# EAGLE design imu_board_v1 (EAGLE 6.5.0)
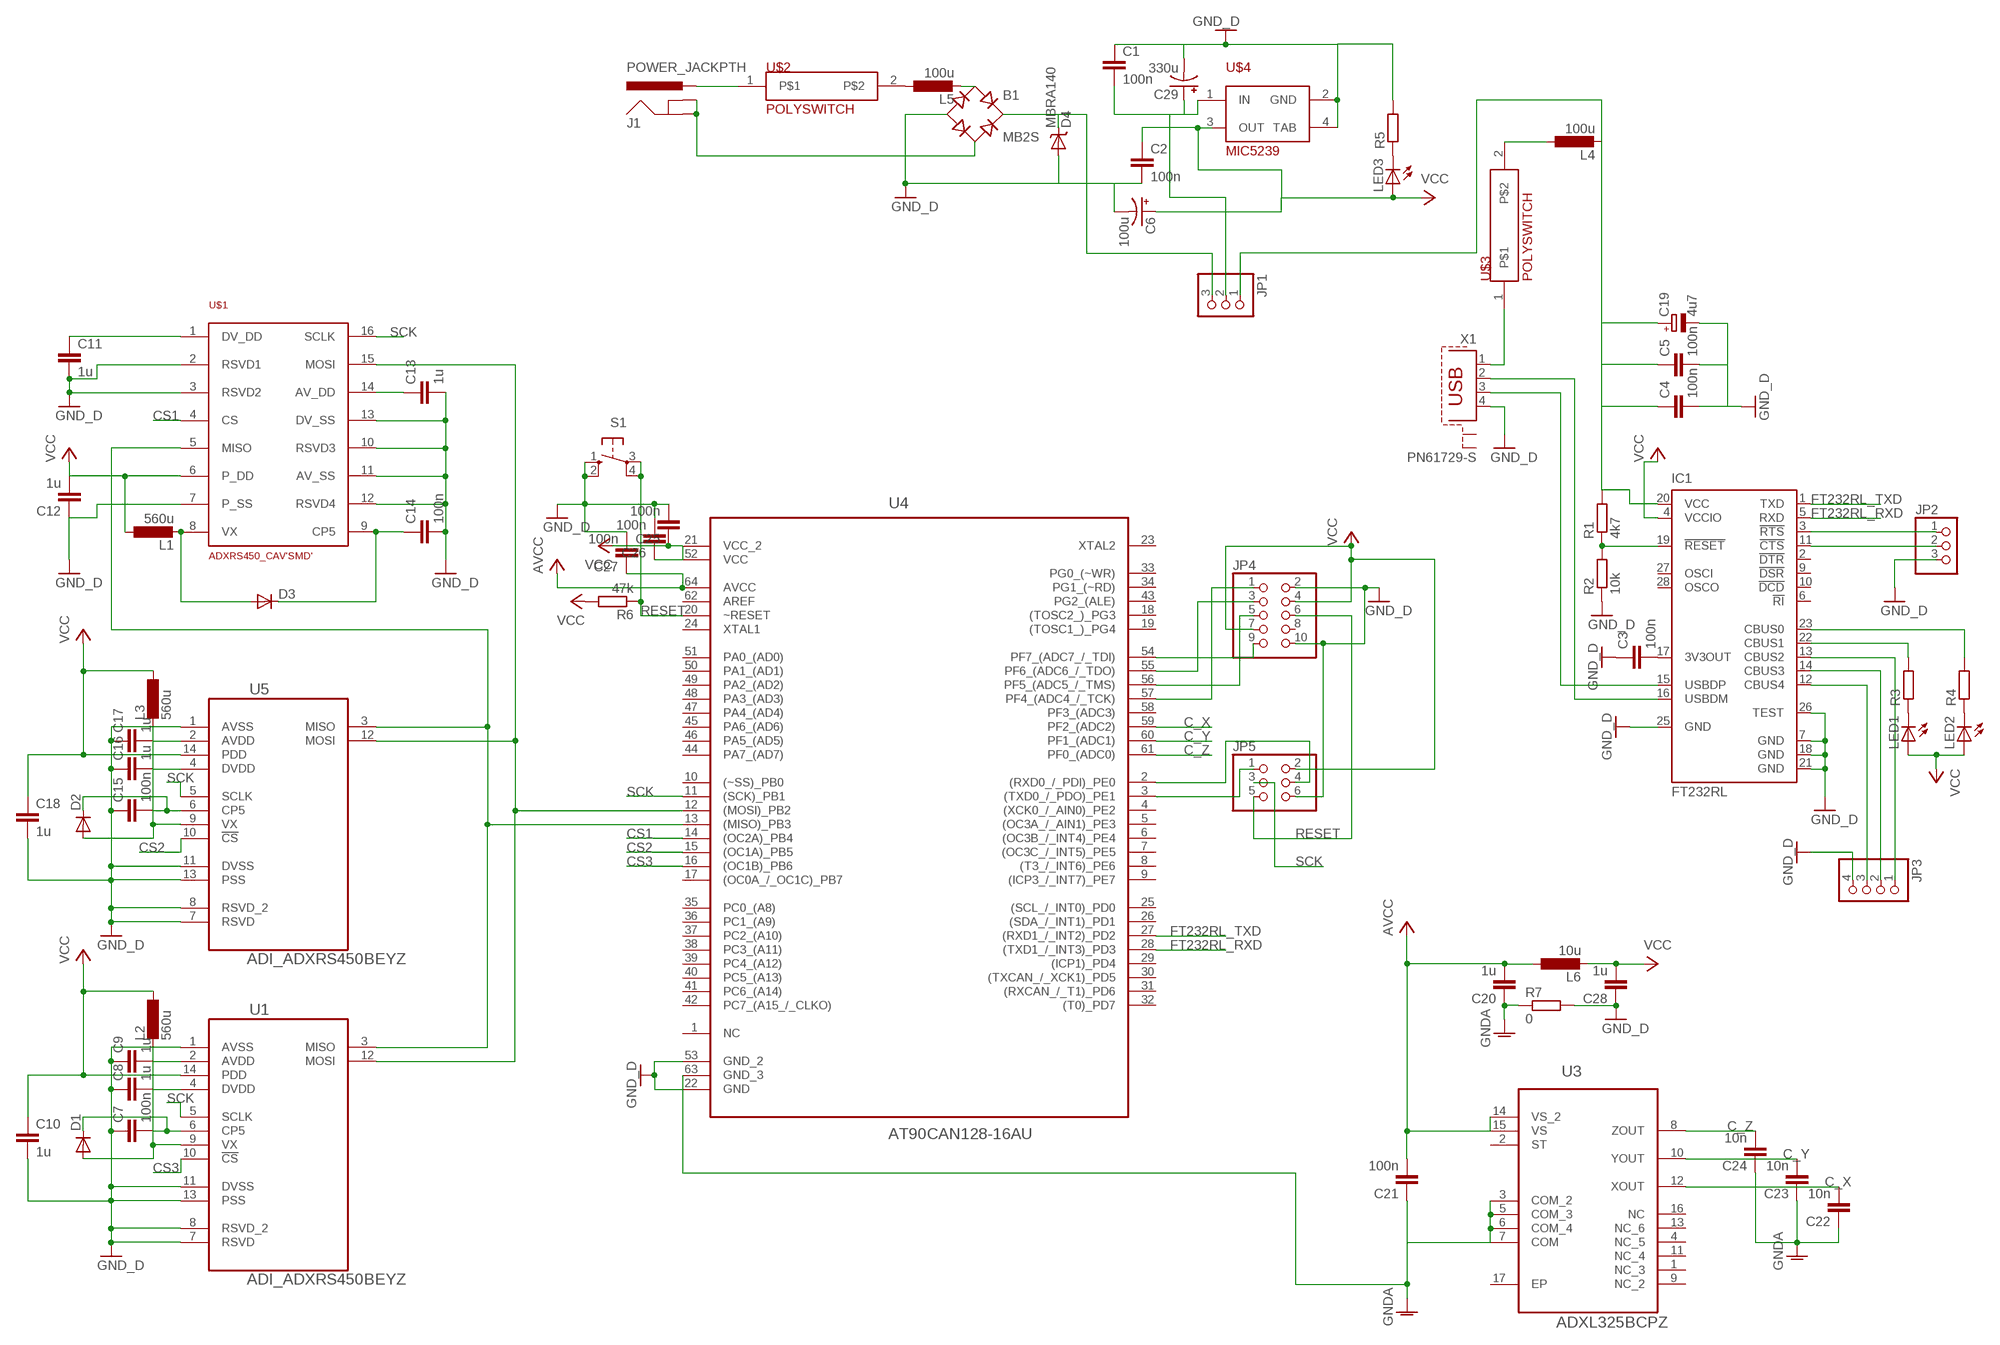
[diagram p0: schematic, sheet 1]

## Parts
B1  MB2S  [SOIC-4]
C1  100n  CAP0603-CAP  [0603-CAP]
C2  100n  CAP0603-CAP  [0603-CAP]
C3  100n  CAP0603-CAP  [0603-CAP]
C4  100n  C-EUC0603  [C0603]
C5  100n  C-EUC0603  [C0603]
C6  100u  CAP_POLG  [PANASONIC_G]
C7  100n  C-EUC0603  [C0603]
C8  1u  C-EUC0603  [C0603]
C9  1u  C-EUC0603  [C0603]
C10  1u  C-EUC0603  [C0603]
C11  1u  C-EUC0603  [C0603]
C12  1u  C-EUC0603  [C0603]
C13  1u  C-EUC0603  [C0603]
C14  100n  C-EUC0603  [C0603]
C15  100n  C-EUC0603  [C0603]
C16  1u  C-EUC0603  [C0603]
C17  1u  C-EUC0603  [C0603]
C18  1u  C-EUC0603  [C0603]
C19  4u7  CPOL-EU153CLV-0405  [153CLV-0405]
C20  1u  C-EUC0603  [C0603]
C21  100n  C-EUC0603  [C0603]
C22  10n  C-EUC0603  [C0603]
C23  10n  C-EUC0603  [C0603]
C24  10n  C-EUC0603  [C0603]
C25  100n  C-EUC0603  [C0603]
C26  100n  C-EUC0603  [C0603]
C27  100n  C-EUC0603  [C0603]
C28  1u  C-EUC0603  [C0603]
C29  330u  CAP_POLG  [PANASONIC_G]
D1  DIODE-SOD123  [SOD123]
D2  DIODE-SOD123  [SOD123]
D3  DIODE-SOD123  [SOD123]
D4  MBRA140  [SMA-DIODE]
IC1  FT232RL  [SSOP28]
J1  POWER_JACKPTH  [POWER_JACK_PTH]
JP1  PINHD-1X3  [1X03]
JP2  PINHD-1X3  [1X03]
JP3  PINHD-1X4  [1X04]
JP4  PINHD-2X5  [2X05]
JP5  PINHD-2X3  [2X03]
L1  560u  L-EUL1812  [L1812]
L2  560u  L-EUL1812  [L1812]
L3  560u  L-EUL1812  [L1812]
L4  100u  L-EUL1812  [L1812]
L5  100u  L-EUL1812  [L1812]
L6  10u  L-EUL1812  [L1812]
LED1  LEDCHIPLED_0603  [CHIPLED_0603]
LED2  LEDCHIPLED_0603  [CHIPLED_0603]
LED3  LEDCHIPLED_0603  [CHIPLED_0603]
R1  4k7  R-EU_R0603  [R0603]
R2  10k  R-EU_R0603  [R0603]
R3  R-EU_R0603  [R0603]
R4  R-EU_R0603  [R0603]
R5  R-EU_R0603  [R0603]
R6  47k  R-EU_R0603  [R0603]
R7  0  R-EU_M1206  [M1206]
S1  10-XX  [B3F-10XX]
U1  ADI_ADXRS450BEYZ  [ADI_ADXRS45XXXX]
U3  ADXL325BCPZ  [QFN65P400X400X150-17N]
U4  AT90CAN128-16AU  [QFP80P1600X1600X120-64N]
U5  ADI_ADXRS450BEYZ  [ADI_ADXRS45XXXX]
U$1  ADXRS450_CAV'SMD'  [SOIC_CAV_16]
U$2  POLYSWITCH  [FUSE]
U$3  POLYSWITCH  [FUSE]
U$4  MIC5239  [SOT-223-3]
X1  PN61729-S  [PN61729-S]

## Nets
AVCC: C20.2 C21.2 C27.1 L6.1 U3.14(VS_2) U3.15(VS) U4.64(AVCC)
C_X: C22.2 U3.12(XOUT) U4.59(PF2_(ADC2))
C_Y: C23.2 U3.10(YOUT) U4.60(PF1_(ADC1))
C_Z: C24.2 U3.8(ZOUT) U4.61(PF0_(ADC0))
CS1: U4.14((OC2A)_PB4) U$1.4(CS)
CS2: U4.15((OC1A)_PB5) U5.10(!CS)
CS3: U1.10(!CS) U4.16((OC1B)_PB6)
FT232RL_RXD: IC1.5(RXD) U4.28((TXD1_/_INT3)_PD3)
FT232RL_TXD: IC1.1(TXD) U4.27((RXD1_/_INT2)_PD2)
GND: B1.- C1.1 C2.2 C3.1 C4.2 C5.2 C6.- C7.1 C8.1 C9.1 C10.2 C11.2 C12.1 C13.2 C14.2 C15.1 C16.1 C17.1 C18.2 C19.- C25.2 C26.2 C27.2 C28.1 C29.- D4.A IC1.7(GND) IC1.18(GND) IC1.21(GND) IC1.25(GND) IC1.26(TEST) JP2.3 JP3.4 JP4.2 JP4.10 JP5.6 R2.1 R5.2 R7.2 S1.1(S) S1.2(S1) U1.1(AVSS) U1.7(RSVD) U1.8(RSVD_2) U1.11(DVSS) U1.13(PSS) U4.22(GND) U4.53(GND_2) U5.1(AVSS) U5.7(RSVD) U5.8(RSVD_2) U5.11(DVSS) U5.13(PSS) U$1.2(RSVD1) U$1.3(RSVD2) U$1.7(P_SS) U$1.10(RSVD3) U$1.11(AV_SS) U$1.12(RSVD4) U$1.13(DV_SS) U$4.2(GND) U$4.4(TAB) X1.4 ; supply symbol labelled GND_D
GNDA: C20.1 C21.1 C22.1 C23.1 C24.1 R7.1 U3.3(COM_2) U3.5(COM_3) U3.6(COM_4) U3.7(COM) U4.63(GND_3)
N$1: J1.PWR U$2.1
N$2: L5.1 U$2.2
N$3: B1.~2(AC2) J1.GND J1.GNDBREAK
N$4: C1.2 C29.+ JP1.2 U$4.1(IN)
N$5: D3.A L1.2 U$1.8(VX)
N$6: JP4.1 U4.57(PF4_(ADC4_/_TCK))
N$7: JP4.3 U4.55(PF6_(ADC6_/_TDO))
N$8: U$3.1 X1.1
N$9: IC1.16(USBDM) X1.2
N$10: C9.2 U1.2(AVDD)
N$11: C8.2 U1.4(DVDD)
N$12: C7.2 D1.C U1.6(CP5)
N$13: C13.1 U$1.14(AV_DD)
N$14: IC1.15(USBDP) X1.3
N$15: C14.1 D3.C U$1.9(CP5)
N$16: C11.1 U$1.1(DV_DD)
N$17: C3.2 IC1.17(3V3OUT)
N$18: IC1.19(!RESET) R1.1 R2.2
N$19: D1.A L2.2 U1.9(VX)
N$20: B1.+ D4.C JP1.3
N$21: LED1.C R3.1
N$22: LED2.C R4.1
N$23: C17.2 U5.2(AVDD)
N$24: C16.2 U5.4(DVDD)
N$25: C15.2 D2.C U5.6(CP5)
N$26: D2.A L3.2 U5.9(VX)
N$27: IC1.22(CBUS1) R3.2
N$28: IC1.23(CBUS0) R4.2
N$29: L4.1 U$3.2
N$30: IC1.3(!RTS) JP2.1
N$31: IC1.11(!CTS) JP2.2
N$32: IC1.13(CBUS2) JP3.1
N$33: JP5.1 U4.3((TXD0_/_PDO)_PE1)
N$34: IC1.14(CBUS3) JP3.2
N$35: IC1.12(CBUS4) JP3.3
N$36: LED3.C R5.1
N$37: B1.~1(AC1) L5.2
N$38: JP5.4 U4.2((RXD0_/_PDI)_PE0)
N$39: JP4.5 U4.56(PF5_(ADC5_/_TMS))
N$40: C4.1 C5.1 C19.+ IC1.20(VCC) JP1.1 L4.2 R1.2
N$41: U1.12(MOSI) U4.12((MOSI)_PB2) U5.12(MOSI) U$1.15(MOSI)
N$44: JP4.9 U4.54(PF7_(ADC7_/_TDI))
N$51: U1.3(MISO) U4.13((MISO)_PB3) U5.3(MISO) U$1.5(MISO)
RESET: JP4.6 JP5.5 R6.1 S1.3(P) S1.4(P1) U4.20(~RESET)
SCK: JP5.3 U1.5(SCLK) U4.11((SCK)_PB1) U5.5(SCLK) U$1.16(SCLK)
VCC: C2.1 C6.+ C10.1 C12.2 C18.1 C25.1 C26.1 C28.2 IC1.4(VCCIO) JP4.4 JP4.7 JP5.2 L1.1 L2.1 L3.1 L6.2 LED1.A LED2.A LED3.A R6.2 U1.14(PDD) U4.21(VCC_2) U5.14(PDD) U$1.6(P_DD) U$4.3(OUT)
Unconnected: IC1.2(!DTR) IC1.6(!RI) IC1.9(!DSR) IC1.10(!DCD) IC1.27(OSCI) IC1.28(OSCO) JP4.8 U3.1(NC_3) U3.2(ST) U3.4(NC_5) U3.9(NC_2) U3.11(NC_4) U3.13(NC_6) U3.16(NC) U3.17(EP) U4.1(NC) U4.4((XCK0_/_AIN0)_PE2) U4.5((OC3A_/_AIN1)_PE3) U4.6((OC3B_/_INT4)_PE4) U4.7((OC3C_/_INT5)_PE5) U4.8((T3_/_INT6)_PE6) U4.9((ICP3_/_INT7)_PE7) U4.10((~SS)_PB0) U4.17((OC0A_/_OC1C)_PB7) U4.18((TOSC2_)_PG3) U4.19((TOSC1_)_PG4) U4.23(XTAL2) U4.24(XTAL1) U4.25((SCL_/_INT0)_PD0) U4.26((SDA_/_INT1)_PD1) U4.29((ICP1)_PD4) U4.30((TXCAN_/_XCK1)_PD5) U4.31((RXCAN_/_T1)_PD6) U4.32((T0)_PD7) U4.33(PG0_(~WR)) U4.34(PG1_(~RD)) U4.35(PC0_(A8)) U4.36(PC1_(A9)) U4.37(PC2_(A10)) U4.38(PC3_(A11)) U4.39(PC4_(A12)) U4.40(PC5_(A13)) U4.41(PC6_(A14)) U4.42(PC7_(A15_/_CLKO)) U4.43(PG2_(ALE)) U4.44(PA7_(AD7)) U4.45(PA6_(AD6)) U4.46(PA5_(AD5)) U4.47(PA4_(AD4)) U4.48(PA3_(AD3)) U4.49(PA2_(AD2)) U4.50(PA1_(AD1)) U4.51(PA0_(AD0)) U4.58(PF3_(ADC3)) U4.62(AREF) X1.S1 X1.S2

## Power pins joined to a net without a drawn wire
VCC: U4.52(VCC)

## Library data of the parts
B1 = rectifier:MB*S: Bridge Rectifier Source: http://www.fairchildsemi.com/ds/MB/MB6S.pdf
C1-C3 = SparkFun-Capacitors:CAP: Capacitor Standard 0603 ceramic capacitor, and 0.1" leaded capacitor.
C4 C5 C7-C18 C20-C28 = rcl:C-EU: CAPACITOR, European symbol
C6 C29 = SparkFun-Capacitors:CAP_POL: Capacitor Polarized These are standard SMD and PTH capacitors. Normally 10uF, 47uF, and 100uF in electrolytic and tantalum varieties. Always verify the external diameter of the through hole cap, it varies with capacity, voltage, and manufacturer. The EIA devices should be standard.
C19 = resistor:CPOL-EU: POLARIZED CAPACITOR, European symbol
D1-D3 = diode:DIODE-: DIODE
D4 = SparkFun-DiscreteSemi:MBRA140: 40V, 1A Schottky rectifier SMA/DO-214AC package DIO-08053; PROD_ID: DIO-08053
IC1 = ftdichip:FT232R: Source: http://www.ftdichip.com/Documents/DataSheets/DS_FT232R_v104.pdf; MPN: FT232RL; OC_FARNELL: 1146032; OC_NEWARK: 91K9918
J1 = SparkFun-Connectors:POWER_JACK: Power Jack This is the standard 5.5mm barrel jack for power. The PTH is the most common, proven, reliable, footprint. The Slot footprint only works if the mill layer is transmitted to the PCB fab house so be warned. Spark Fun Electronics SKU : PRT-00119 SMT: CONN-08106 Mating wall wart : TOL-00298 (and others)
JP1 JP2 = pinhead:PINHD-1X3: PIN HEADER
JP3 = pinhead:PINHD-1X4: PIN HEADER
JP4 = pinhead:PINHD-2X5: PIN HEADER
JP5 = pinhead:PINHD-2X3: PIN HEADER
L1-L6 = rcl:L-EU: INDUCTOR, European symbol
LED1-LED3 = led:LED: LED OSRAM: - CHIPLED LG R971, LG N971, LY N971, LG Q971, LY Q971, LO R971, LY R971 LH N974, LH R974 LS Q976, LO Q976, LY Q976 LO Q996 - Hyper CHIPLED LW Q18S LB Q993, LB Q99A, LB R99A - SideLED LS A670, LO A670, LY A670, LG A670, LP A670 LB A673, LV A673, LT A673, LW A673 LH A674 LY A675 LS A676, LA A676, LO A676, LY A676, LW A676 LS A679, LY A679, LG A679 - Hyper Micro SIDELED® LS Y876, LA Y876, LO Y876, LY Y876 LT Y87S - SmartLED LW L88C, LW L88S LB L89C, LB L89S, LG L890 LS L89K, LO L89K, LY L89K LS L896, LA L896, LO L896, LY L896 - TOPLED LS T670, LO T670, LY T670, LG T670, LP T670 LSG T670, LSP T670, LSY T670, LOP T670, LYG T670 LG T671, LOG T671, LSG T671 LB T673, LV T673, LT T673, LW T673 LH T674 LS T676, LA T676, LO T676, LY T676, LB T676, LH T676, LSB T676, LW T676 LB T67C, LV T67C, LT T67C, LS T67K, LO T67K, LY T67K, LW E67C LS E67B, LA E67B, LO E67B, LY E67B, LB E67C, LV E67C, LT E67C LW T67C LS T679, LY T679, LG T679 LS T770, LO T770, LY T770, LG T770, LP T770 LB T773, LV T773, LT T773, LW T773 LH T774 LS E675, LA E675, LY E675, LS T675 LS T776, LA T776, LO T776, LY T776, LB T776 LHGB T686 LT T68C, LB T68C - Hyper Mini TOPLED® LB M676 - Mini TOPLED Santana® LG M470 LS M47K, LO M47K, LY M47K Source: http://www.osram.convergy.de LUXEON: - LUMILED® LXK2-PW12-R00, LXK2-PW12-S00, LXK2-PW14-U00, LXK2-PW14-V00 LXK2-PM12-R00, LXK2-PM12-S00, LXK2-PM14-U00 LXK2-PE12-Q00, LXK2-PE12-R00, LXK2-PE12-S00, LXK2-PE14-T00, LXK2-PE14-U00 LXK2-PB12-K00, LXK2-PB12-L00, LXK2-PB12-M00, LXK2-PB14-N00, LXK2-PB14-P00, LXK2-PB14-Q00 LXK2-PR12-L00, LXK2-PR12-M00, LXK2-PR14-Q00, LXK2-PR14-R00 LXK2-PD12-Q00, LXK2-PD12-R00, LXK2-PD12-S00 LXK2-PH12-R00, LXK2-PH12-S00 LXK2-PL12-P00, LXK2-PL12-Q00, LXK2-PL12-R00 Source: www.luxeon.com KINGBRIGHT: KA-3528ASYC Source: www.kingbright.com
R1-R6 = rcl:R-EU_: RESISTOR, European symbol
R7 = resistor:R-EU_: RESISTOR, European symbol
S1 = switch-omron:10-XX: OMRON SWITCH; MPN: B3F-1000; OC_FARNELL: 176432; OC_NEWARK: 36M3542
U1 U5 = ADI-ADL5324_ADXRS45xx:ADI_ADXRS: GYROSCOPE, 300 DEG/SEC, 14LCC; MPN: ADXRS450BEYZ; OC_FARNELL: 1897080; OC_NEWARK: 31T9300; PACKAGE: 14LCC; SUPPLIER: ANALOG DEVICES
U3 = ADXL325:ADXL325BCPZ: Small, Low Power, 3-Axis ±5 g Accelerometer; MPN: ADXL325BCPZ; OC_FARNELL: 1786063; OC_NEWARK: 05R6561; PACKAGE: LFCSP-16; SUPPLIER: Analog Devices
U4 = AT90CAN128:AT90CAN128-16AU: CAN Controller; MPN: AT90CAN128-16AU; OC_FARNELL: 1455065; OC_NEWARK: 58M3860; PACKAGE: TQFP-64; SUPPLIER: Atmel
U$1 = ADXRS450_SOIC:ADXRS450_CAV
U$2 U$3 = POLYSWITCH:POLYSWITCH
U$4 = MIC5239-3.3:MIC5239
X1 = con-berg:PN61729-S: BERG USB connector; OC_FARNELL: unknown; OC_NEWARK: unknown

## Board
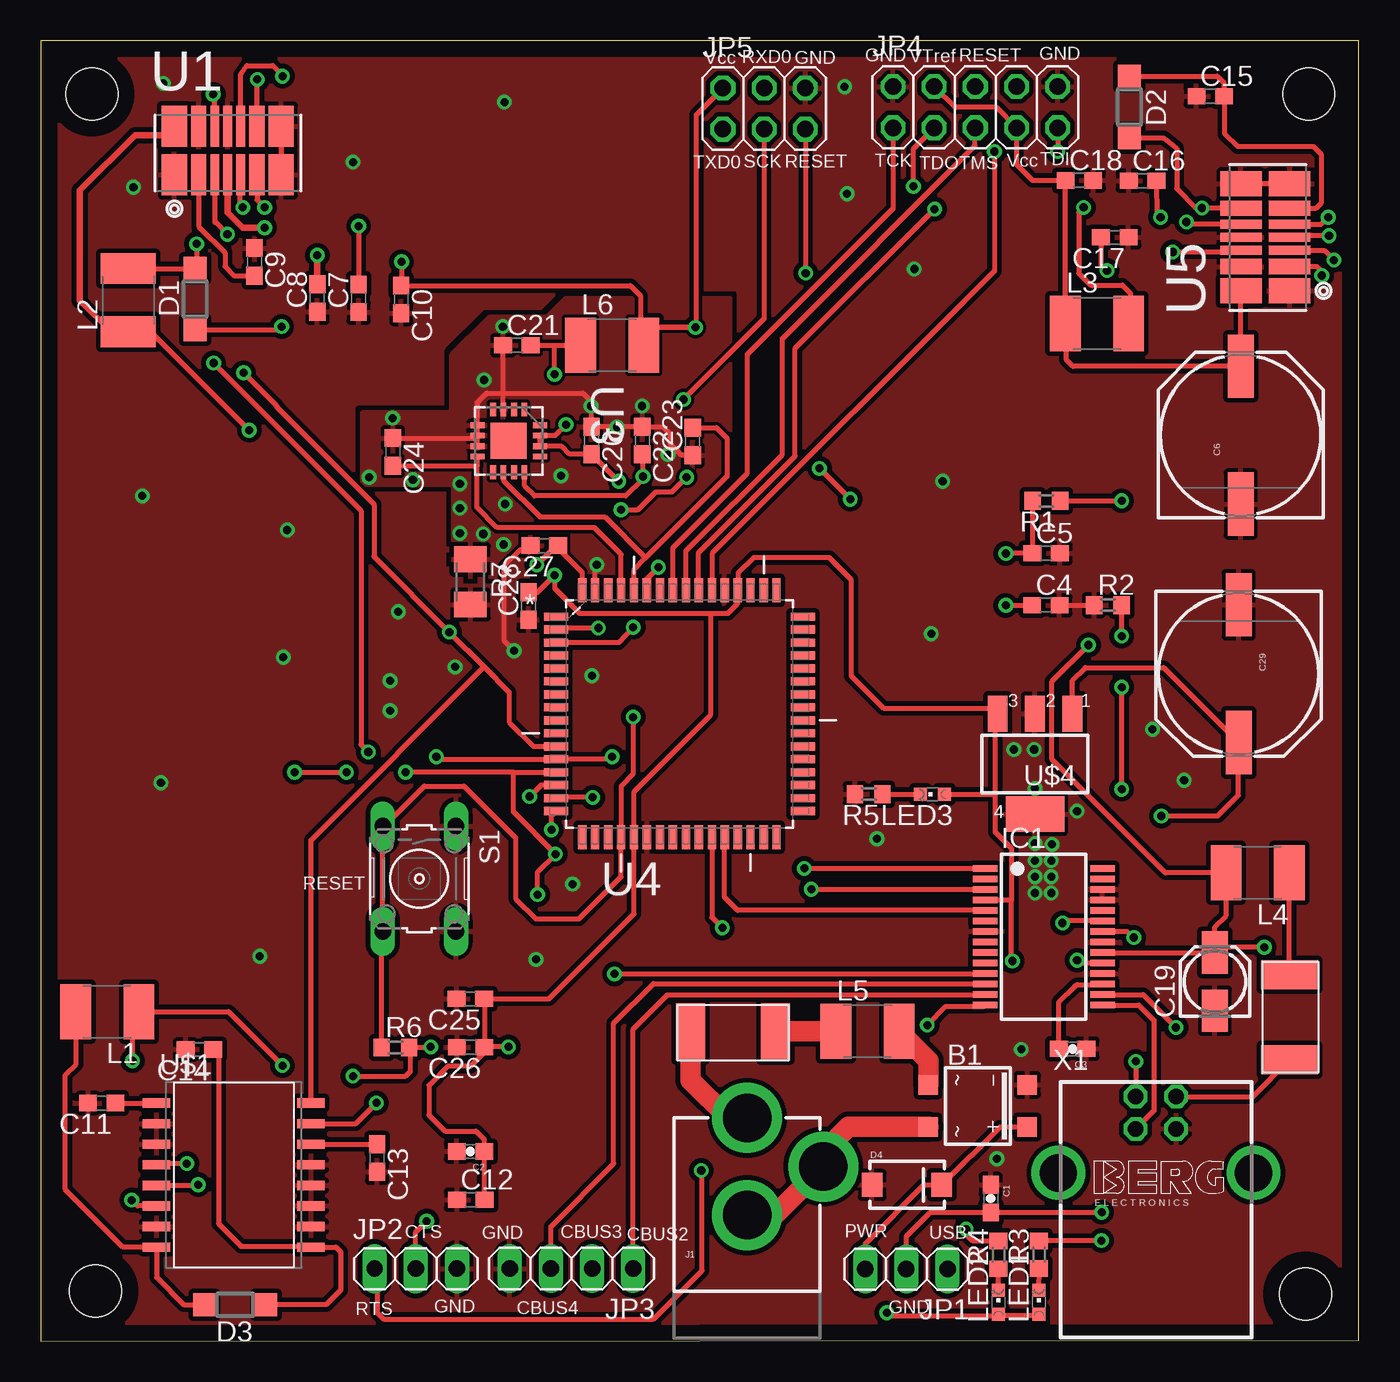
[diagram p1: board, top side]
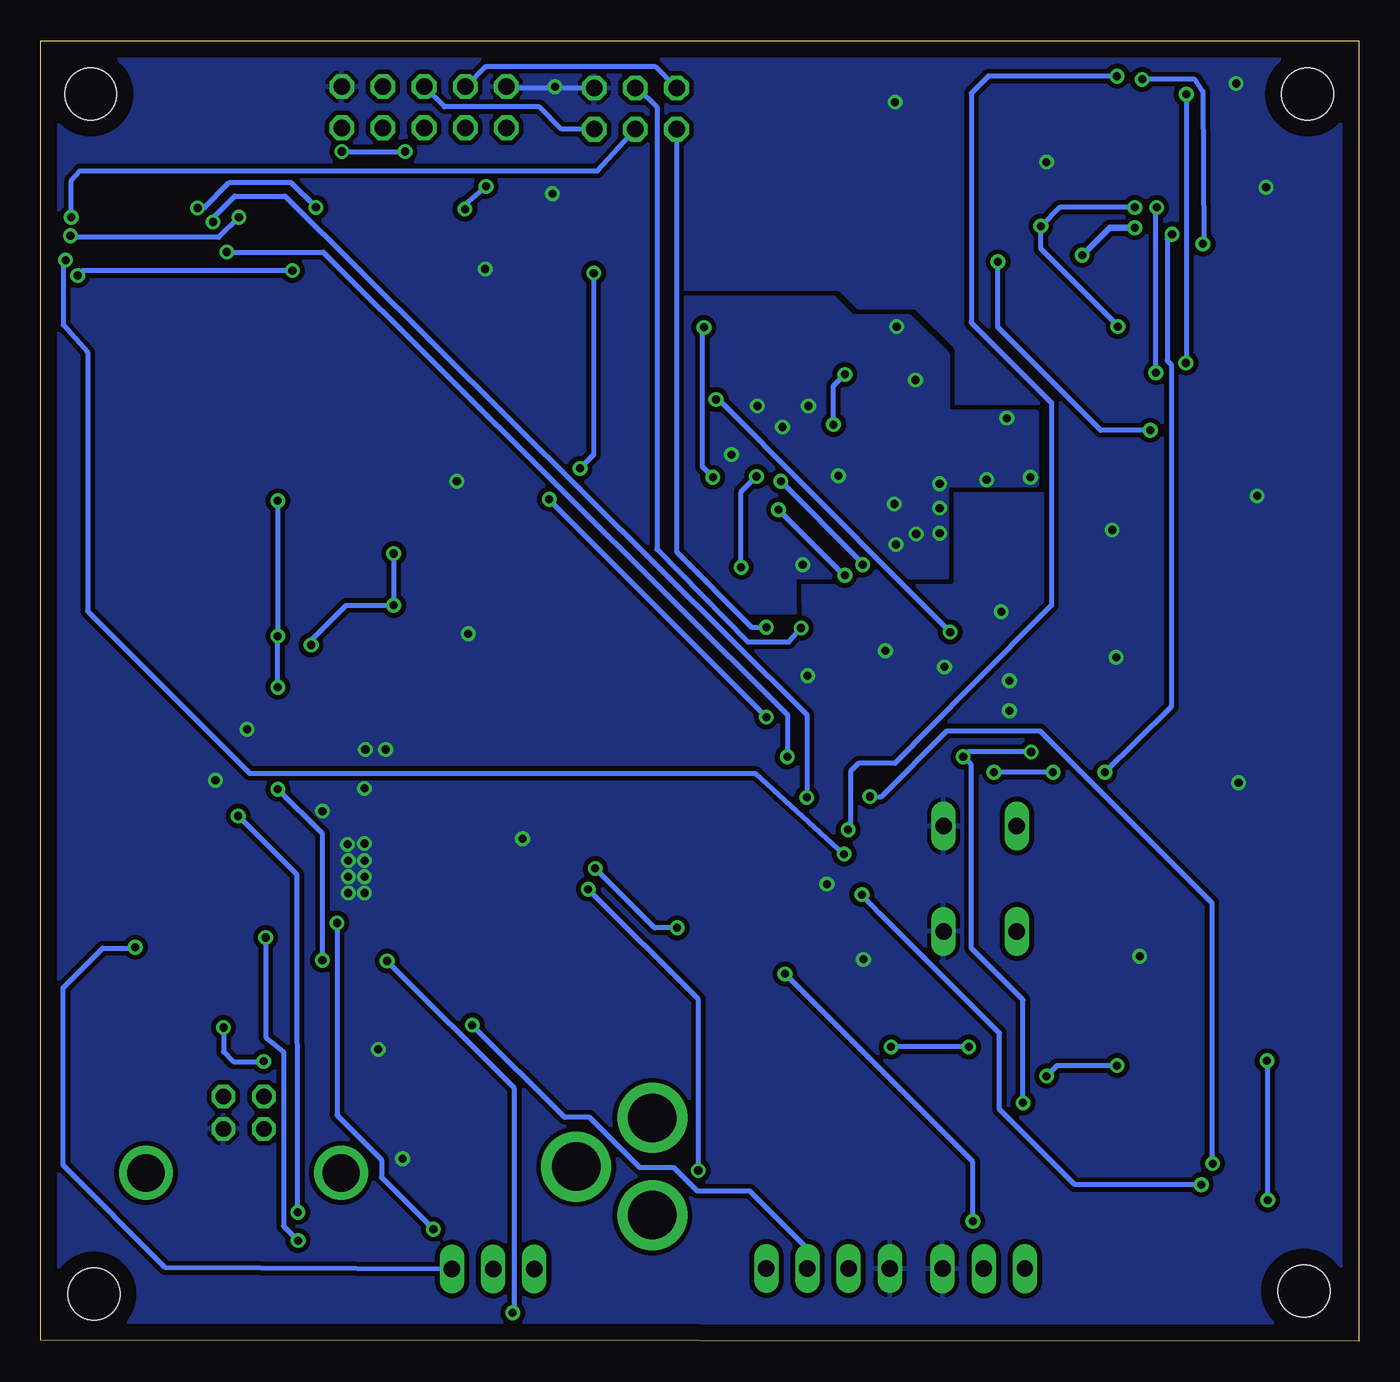
[diagram p2: board, bottom side, seen from below]

Size 81.39 x 80.26 mm. Coordinates in mm from the lower left corner, seen from the top.
Outline: 0,0 81.39,0.06 81.39,80.26 0.02,80.26 0,0
Copper layers (1*16): Top 0.035mm / dielectric 1.5mm / Bottom 0.035mm
Design rules "default": minimum track width 10mil, minimum drill 0.5mm, track to track 8mil, track to pad 8mil, pad to pad 8mil, via to via 8mil, smd to smd 8mil, copper to edge 40mil, drill to drill 8mil, minimum pad ring 10mil, minimum via ring 8mil, stop-mask expansion 4mil, vias tented up to drill 0.6mm, thermal gap 10mil
Holes 3.2 mm at 3.4,3.1 78.09,2.91 3.17,76.96 78.29,76.96

### Footprints (pad centres in the part's own frame; a part is rotated, then mirrored left to right if it is on the bottom)
SOIC-4 = smd 1.2 x 1.2: + 1.3,3.05; - -1.3,3.05; ~1 -1.3,-3.05; ~2 1.3,-3.05
0603-CAP = smd 1.1 x 1: 1 -0.85,0; 2 0.85,0
C0603 = smd 1.1 x 1: 1 -0.85,0; 2 0.85,0
PANASONIC_G = smd 3.9 x 1.6: + 4.25,0; - -4.25,0
153CLV-0405 = smd 2.6 x 1.6: + 1.8,0; - -1.8,0
SOD123 = smd 1.4 x 1.4: A 1.9,0; C -1.9,0
SMA-DIODE = smd 1.27 x 1.47: A -2.15,0; C 2.15,0
SSOP28 = smd 0.4 x 1.5: 1 -4.225,-3.625; 2 -3.575,-3.625; 3 -2.925,-3.625; 4 -2.275,-3.625; 5 -1.625,-3.625; 6 -0.975,-3.625; 7 -0.325,-3.625; 8 0.325,-3.625; 9 0.975,-3.625; 10 1.625,-3.625; 11 2.275,-3.625; 12 2.925,-3.625; 13 3.575,-3.625; 14 4.225,-3.625; 15 4.225,3.625; 16 3.575,3.625; 17 2.925,3.625; 18 2.275,3.625; 19 1.625,3.625; 20 0.975,3.625; 21 0.325,3.625; 22 -0.325,3.625; 23 -0.975,3.625; 24 -1.625,3.625; 25 -2.275,3.625; 26 -2.925,3.625; 27 -3.575,3.625; 28 -4.225,3.625
POWER_JACK_PTH = drill 2.997 pad 4.318: GND 0,7.7; GNDBREAK 4.7,10.7; PWR 0,13.7
1X03 = drill 1.016 long: 1 -2.54,0; 2 0,0; 3 2.54,0
1X04 = drill 1.016 long: 1 -3.81,0; 2 -1.27,0; 3 1.27,0; 4 3.81,0
2X05 = drill 1.016 octagon: 1 -5.08,-1.27; 2 -5.08,1.27; 3 -2.54,-1.27; 4 -2.54,1.27; 5 0,-1.27; 6 0,1.27; 7 2.54,-1.27; 8 2.54,1.27; 9 5.08,-1.27; 10 5.08,1.27
2X03 = drill 1.016 octagon: 1 -2.54,-1.27; 2 -2.54,1.27; 3 0,-1.27; 4 0,1.27; 5 2.54,-1.27; 6 2.54,1.27
L1812 = smd 1.9 x 3.4: 1 -1.95,0; 2 1.95,0
CHIPLED_0603 = smd 0.8 x 0.8: A 0,-0.75; C 0,0.75
R0603 = smd 1 x 1.1: 1 -0.85,0; 2 0.85,0
M1206 = smd 1.6 x 2: 1 -1.4,0; 2 1.4,0
B3F-10XX = drill 1.016 long: 1 -3.251,2.261; 2 3.251,2.261; 3 -3.251,-2.261; 4 3.251,-2.261
ADI_ADXRS45XXXX = smd 1.55 x 2.55: 1 -3.3,-1.5; 7 3.3,-1.5; 8 3.3,1.5; 14 -3.3,1.5 | smd 0.95 x 2.55: 2 -1.8,-1.5; 6 1.8,-1.5; 9 1.8,1.5; 13 -1.8,1.5 | smd 0.55 x 2.55: 3 -0.8,-1.5; 4 0,-1.5; 5 0.8,-1.5; 10 0.8,1.5; 11 0,1.5; 12 -0.8,1.5
QFN65P400X400X150-17N = smd 0.864 x 0.356: 1 -1.93,0.965; 2 -1.93,0.33; 3 -1.93,-0.33; 4 -1.93,-0.965; 9 1.93,-0.965; 10 1.93,-0.33; 11 1.93,0.33; 12 1.93,0.965 | smd 0.356 x 0.864: 5 -0.965,-1.93; 6 -0.33,-1.93; 7 0.33,-1.93; 8 0.965,-1.93; 13 0.965,1.93; 14 0.33,1.93; 15 -0.33,1.93; 16 -0.965,1.93 | smd 2.21 x 2.21: 17 0,0
QFP80P1600X1600X120-64N = smd 1.473 x 0.508: 1 -7.62,5.994; 2 -7.62,5.207; 3 -7.62,4.394; 4 -7.62,3.607; 5 -7.62,2.794; 6 -7.62,2.007; 7 -7.62,1.194; 8 -7.62,0.406; 9 -7.62,-0.406; 10 -7.62,-1.194; 11 -7.62,-2.007; 12 -7.62,-2.794; 13 -7.62,-3.607; 14 -7.62,-4.394; 15 -7.62,-5.207; 16 -7.62,-5.994; 33 7.62,-5.994; 34 7.62,-5.207; 35 7.62,-4.394; 36 7.62,-3.607; 37 7.62,-2.794; 38 7.62,-2.007; 39 7.62,-1.194; 40 7.62,-0.406; 41 7.62,0.406; 42 7.62,1.194; 43 7.62,2.007; 44 7.62,2.794; 45 7.62,3.607; 46 7.62,4.394; 47 7.62,5.207; 48 7.62,5.994 | smd 0.508 x 1.473: 17 -5.994,-7.62; 18 -5.207,-7.62; 19 -4.394,-7.62; 20 -3.607,-7.62; 21 -2.794,-7.62; 22 -2.007,-7.62; 23 -1.194,-7.62; 24 -0.406,-7.62; 25 0.406,-7.62; 26 1.194,-7.62; 27 2.007,-7.62; 28 2.794,-7.62; 29 3.607,-7.62; 30 4.394,-7.62; 31 5.207,-7.62; 32 5.994,-7.62; 49 5.994,7.62; 50 5.207,7.62; 51 4.394,7.62; 52 3.607,7.62; 53 2.794,7.62; 54 2.007,7.62; 55 1.194,7.62; 56 0.406,7.62; 57 -0.406,7.62; 58 -1.194,7.62; 59 -2.007,7.62; 60 -2.794,7.62; 61 -3.607,7.62; 62 -4.394,7.62; 63 -5.207,7.62; 64 -5.994,7.62
SOIC_CAV_16 = smd 1.691 x 0.572: 1 -4.771,5.08; 2 -4.771,3.81; 3 -4.771,2.54; 4 -4.771,1.27; 5 -4.771,0; 6 -4.771,-1.27; 7 -4.771,-2.54; 8 -4.771,-3.81; 9 4.771,-3.81; 10 4.771,-2.54; 11 4.771,-1.27; 12 4.771,0; 13 4.771,1.27; 14 4.771,2.54; 15 4.771,3.81; 16 4.771,5.08
FUSE = smd 1.78 x 3.5: 1 2.615,0; 2 -2.615,0
SOT-223-3 = smd 1.219 x 2.235: 1 -2.311,-3.099; 2 0,-3.099; 3 2.311,-3.099 | smd 3.6 x 2.2: 4 0,3.099
PN61729-S = drill 0.95 octagon: 1 1.25,4.71; 2 -1.25,4.71; 3 -1.25,2.71; 4 1.25,2.71 | drill 2.3 pad 2.9: S1 -6.02,0; S2 6.02,0

### Placement (x,y rotation side)
B1  57.86,14.52 270 top
C1  58.66,8.79 270 top
C2  26.54,11.71 180 top
C3  63.72,18.04 180 top
C4  62.06,45.41 0 top
C5  62.07,48.62 0 top
C6  74.09,55.91 90 top
C7  19.64,64.35 90 top
C8  17.09,64.36 90 top
C9  13.21,66.6 270 top
C10  22.27,64.29 270 top
C11  3.78,14.7 180 top
C12  26.56,8.72 0 top
C13  20.78,11.29 270 top
C14  9.81,18 180 top
C15  72.2,76.82 0 top
C16  68.02,71.6 0 top
C17  66.31,68.11 180 top
C18  64.12,71.62 0 top
C19  72.49,22.18 90 top
C20  34.01,55.58 270 top
C21  29.41,61.45 0 top
C22  37.14,55.57 270 top
C23  40.25,55.52 90 top
C24  21.75,54.88 270 top
C25  26.53,21.12 180 top
C26  26.55,18.14 180 top
C27  31.09,49.09 180 top
C28  30.13,45.35 90 top
C29  73.95,41.19 270 top
D1  9.55,64.31 90 top
D2  67.2,76.16 270 top
D3  12.01,2.25 180 top
D4  53.48,9.64 0 top
IC1  61.93,24.95 270 top
J1  43.61,0.07 0 top
JP1  53.45,4.44 180 top
JP2  23.16,4.47 0 top
JP3  32.78,4.48 180 top
JP4  57.7,76.14 0 top
JP5  44.67,76.06 0 top
L1  4.12,20.33 180 top
L2  5.43,64.24 90 top
L3  65.22,62.8 0 top
L4  75.13,28.89 180 top
L5  51.05,19.11 0 top
L6  35.28,61.45 0 top
LED1  61.64,2.41 0 top
LED2  59.14,2.41 0 top
LED3  55.05,33.75 90 top
R1  62.09,51.85 180 top
R2  65.89,45.42 0 top
R3  61.64,5.33 90 top
R4  59.14,5.32 90 top
R5  51.12,33.76 180 top
R6  21.91,18.12 0 top
R7  26.54,46.85 270 top
S1  23.38,28.54 270 top
U1  11.56,73.47 0 top
U3  28.9,55.56 270 top
U4  39.44,38.7 0 top
U5  75.6,68.11 90 top
U$1  11.93,9.61 0 top
U$2  42.74,19.09 180 top
U$3  77.09,19.98 270 top
U$4  61.39,35.62 180 top
X1  68.86,10.38 0 top

### Tracks (layer width: path | path; a pad name or v marks a point on that pad's centre or on a via)
AVCC  (via drill 0.5, 0.5 pad 0.25)
  Top 0.3: C21.2 31.64,61.45 | 31.64,61.45 33.23,61.45 L6.1 | v31.74,59.66 31.74,61.35 31.64,61.45 | v32.44,56.55 31.77,55.89 U3.15 U3.14 30.85,55.2 32.19,55.2 32.66,54.73 C20.2 v35.69,53.05 | U4.64 33.44,47.45 32.05,48.84 C27.1 31.82,49.09 v30.64,47.91
  Bottom 0.3: v32.44,56.55 32.44,58.95 v31.74,59.66 | v30.64,47.91 30.74,48.1 v35.69,53.05
C_X  (via drill 0.5, 0.5 pad 0.25)
  Top 0.3: U4.59 37.43,47.05 v38.14,47.76 | C22.2 37.14,53.4 | 37.14,53.4 v37.19,53.35 | 37.14,53.4 37.14,53.16 36.14,52.16 30.49,52.16 29.89,52.76 29.89,53.6 U3.12
  Bottom 0.3: v37.19,53.35 38.14,52.41 v38.14,47.76
C_Y
  Top 0.3: U4.60 36.64,47.61 37.36,48.33 | 37.36,48.33 42.39,53.35 42.39,55.7 41.72,56.37 C23.2 | U3.10 28.57,53.12 30.84,50.85 34.84,50.85 37.36,48.33
C_Z
  Top 0.3: C24.2 26.97,54.02 | 26.97,54.02 U3.8 26.99,54.59 | U4.61 35.84,48.55 34.19,50.2 28.18,50.2 26.93,51.45 26.93,53.99 26.97,54.02
CS1  (via drill 0.5, 0.5 pad 0.25)
  Top 0.3: v9.04,10.96 7.23,10.96 U$1.4 | U4.14 30.89,34.31 v30.18,33.6
  Bottom 0.3: v9.04,10.96 9.09,11 9.09,27.05 19.68,37.66 25.43,37.66 29.49,33.6 v30.18,33.6
CS2  (via drill 0.5 pad 0.25)
  Top 0.3: U5.10 70.88,68.91 v70.73,69.06 | v34.09,33.55 31.87,33.55 U4.15
  Bottom 0.3: v70.73,69.06 70.73,69.31 69.39,70.66 66.29,70.66 34.09,38.66 v34.09,33.55
CS3  (via drill 0.5 pad 0.25)
  Top 0.3: v31.54,31.55 31.54,32.43 U4.16 | U1.10 12.36,78.18 12.74,78.71 14.34,78.71 v14.93,78.06
  Bottom 0.3: 23.93,40.45 24.06,40.33 | 24.06,40.33 28.64,35.66 30.89,35.66 31.39,35.16 31.39,31.7 v31.54,31.55 | v14.93,78.06 22.89,78.06 23.93,77.01 23.93,62.85 18.99,57.91 18.99,45.4 24.06,40.33
FT232RL_RXD
  Top 0.3: IC1.5 43.03,26.58 42.23,27.38 U4.28
FT232RL_TXD  (via drill 0.5 pad 0.25)
  Top 0.3: U4.27 41.44,26.15 v42.09,25.5 | v47.15,29.18 IC1.1
  Bottom 0.3: v42.09,25.5 43.48,25.5 v47.15,29.18
GND  (via drill 0.5, 0.5 pad 0.25)
  Top 0.3: U5.7 U5.8 | C4.2 R2.1 | U1.8 U1.7 | C27.2 29.63,48.84 28.59,47.8 28.59,43.26 v29.24,42.6
  Bottom 0.3: JP5.6 52.54,77.33 JP4.2
  other vias: 53.94,66.16 19.29,72.76 68.64,37.76 70.59,34.6 54.98,43.66 49.79,70.81 49.64,77.41 22.09,45.01 30.59,23.55 28.64,76.46 32.84,28.2 7.44,34.45 13.54,23.75 25.59,41.6 34.03,41.05 14.99,42.2 51.64,31 60.54,18 59.04,11.25 7.59,77.61 5.74,71.21 21.59,40.76 21.59,38.91 15.24,50.05 6.29,52.16 55.69,53.05 61.39,30.7 63.98,32.7 62.44,30.66 61.39,29.66 62.39,29.66 61.39,28.66 62.39,28.66 61.39,27.66 62.39,27.66 61.39,34.1 60.09,36.51 61.34,36.51
  pour Bottom (isolate 0.3, rank 2): -0.33,80.56 -0.45,-0.45 81.98,-0.4 81.98,80.56
  pour Top (isolate 0.3, rank 2): -1.26,81.41 83.34,81.41 83.34,-2.04 -1.51,-2.04 -1.51,-0.79 -1.51,81.21
GNDA  (via drill 0.5)
  Top 0.3: C24.1 26.8,55.73 U3.6 | U3.6 U3.5 26.97,57.94 27.54,58.51 28.54,58.51 | U3.7 U3.6 | 28.54,58.51 28.54,57.52 U3.3 | U3.3 28.57,61.44 C21.1 | U3.3 28.57,58.47 28.54,58.51 | C23.1 39.57,54.67 38.89,55.35 38.89,55.95 38.44,56.41 37.16,56.41 C22.1 34.02,56.42 C20.1 33.98,56.45 33.98,58.01 33.48,58.51 28.54,58.51 | U4.63 34.23,47.8 v34.34,47.91
  other vias: 27.39,59.3 28.68,51.66 32.14,53.41 25.89,52.91 25.89,49.85 27.34,49.8 28.59,49.16 25.89,51.41 21.74,56.95 22.99,53.16 20.29,53.3 28.54,62.6 33.98,57.7 37.14,57.7 38.73,54.7 35.59,56.41
  pour Top: 34.78,45.1 34.84,45.1 34.84,47.16 25.49,47.16 25.49,52.85 19.89,52.85 19.89,52.95 19.89,57.3 25.39,57.3 25.39,57.41 25.39,60.85 27.74,63.2 31.29,63.2 32.44,64.36 42.53,64.36 42.53,52.41 42.53,49.2 38.34,45.01 34.89,45.01 34.84,44.95
  pour Bottom (isolate 0.3): 34.78,45.1 34.84,45.1 34.84,47.16 25.43,47.16 25.43,52.85 19.89,52.85 19.89,57.3 25.39,57.3 25.39,60.85 27.74,63.2 31.29,63.2 32.44,64.36 42.53,64.36 42.53,49.2 38.34,45.01 34.89,45.01 34.84,44.95
N$1
  Top 0.3: U$2.1
  Top 1.27: J1.PWR 42.47,13.78 40.12,16.11 U$2.1
N$2
  Top 0.3: 45.38,19.11 U$2.2
  Top 1.27: L5.1 45.38,19.11
N$3
  Top 0.3: B1.~2
  Top 1.27: B1.~2 49.88,13.22 48.32,11.66 J1.GNDBREAK 45.31,7.77 J1.GND
N$4  (via drill 0.5 pad 0.25)
  Top 0.3: C1.2 59.19,7.94 | 59.19,7.94 65.44,7.94 v65.51,7.96 | v69.19,32.41 72.69,32.41 73.95,33.67 C29.+ 69.34,41.55 64.48,41.55 63.7,40.77 U$4.1 | JP1.2 53.45,6.46 54.94,7.96 59.17,7.96 59.19,7.94
  Bottom 0.3: v65.51,7.96 65.56,28.77 v69.19,32.41
N$5
  Top 0.3: L1.2 2.2,20.31 2.2,17.09 1.54,16.43 1.54,9.36 5.09,5.8 U$1.8 7.16,3.93 8.84,2.26 D3.A
N$6
  Top 0.3: U4.57 39.03,48.95 43.64,53.55 43.64,60.91 52.64,69.91 JP4.1
N$7  (via drill 0.5 pad 0.25)
  Top 0.3: U4.55 40.63,48.65 46.59,54.6 46.59,61.26 v55.19,69.86 | v53.89,71.26 53.89,73.59 JP4.3
  Bottom 0.3: v55.19,69.86 55.19,70.16 v53.89,71.26
N$8
  Top 0.3: X1.1 74.82,15.09 U$3.1
N$9  (via drill 0.5 pad 0.25)
  Top 0.3: IC1.16 68.06,21.38 v70.09,19.36 | v67.61,17.27 X1.2
  Bottom 0.3: v70.09,19.36 70.09,17.86 69.48,17.25 67.62,17.25 v67.61,17.27
N$10
  Top 0.3: U1.2 9.76,68.78 11.39,67.16 11.39,66.31 11.94,65.76 C9.2
N$11  (via drill 0.5)
  Top 0.406: U1.4 11.56,69.63 12.49,68.71 v13.84,68.71 | v17.09,67.01 C8.2
  Bottom 0.406: v13.84,68.71 15.39,68.71 v17.09,67.01
N$12  (via drill 0.5 pad 0.25)
  Top 0.3: U1.6 13.36,70.43 v13.84,69.96 | v19.64,68.81 C7.2 | D1.C 14.68,62.41 v14.89,62.6
  Bottom 0.3: v13.84,69.96 18.49,69.96 v19.64,68.81 19.64,67.41 14.89,62.66 v14.89,62.6
N$13
  Top 0.3: U$1.14 C13.1
N$14
  Top 0.3: X1.3 67.62,13.09 68.73,14.21 68.73,19.8 67.81,20.73 IC1.15
N$15
  Top 0.3: D3.C 13.92,2.26 17.64,2.26 18.54,3.16 18.54,5.5 18.24,5.8 U$1.9 16.65,5.85 12.39,5.85 10.99,7.25 10.99,18 10.98,18 C14.1
N$16
  Top 0.3: C11.1 U$1.1
N$17
  Top 0.3: C3.2 62.87,20.93 63.84,21.91 63.89,21.91 63.98,22 65.53,22 IC1.17
N$18  (via drill 0.5 pad 0.25)
  Top 0.3: IC1.19 64.16,23.33 v63.98,23.5 | v66.73,34.05 v66.73,40.35 | v66.73,43.51 R2.2 | R1.1 v66.73,51.85
  Bottom 0.3: v63.98,23.5 63.98,31.3 v66.73,34.05 | v66.73,40.35 v66.73,43.51 v66.73,51.85
N$19  (via drill 0.5 pad 0.25)
  Top 0.3: L2.2 9.53,66.19 D1.A 9.64,66.3 v9.64,67.71 | U1.9 13.36,77.38 v13.39,77.86
  Bottom 0.3: 9.69,67.76 v9.64,67.71 9.59,67.76 9.64,77.11 10.14,77.86 v13.39,77.86
N$20
  Top 0.3: B1.+ 59.2,13.21 D4.C 54.54,9.65 50.91,6.02 JP1.3
N$21
  Top 0.3: LED1.C 61.65,4.47 R3.1
N$22
  Top 0.3: 59.12,4.46 R4.1 LED2.C
N$23  (via drill 0.5)
  Top 0.3: C17.2 65.46,66.43 v65.84,66.06 | v79.09,65.76 79.09,66.01 78.79,66.31 U5.2
  Bottom 0.3: v65.84,66.06 78.79,66.06 v79.09,65.76
N$24  (via drill 0.5, 0.5 pad 0.25)
  Top 0.3: C16.2 68.92,69.42 v69.14,69.36 | U5.4 77.2,68.21 v79.54,68.21
  Bottom 0.3: v69.14,69.36 70.39,68.11 79.44,68.11 v79.54,68.21
N$25
  Top 0.3: D2.C 72.64,78.06 73.04,77.66 73.04,76.84 C15.2 73.12,76.76 73.12,74.48 73.89,73.71 78.59,73.71 79.09,73.21 79.09,70.26 78.74,69.91 U5.6
N$26  (via drill 0.5 pad 0.25)
  Top 0.3: D2.A 69.34,74.26 70.14,73.61 70.14,71.12 71.34,69.92 v71.69,69.92 74.09,69.92 U5.9 | v64.39,69.96 64.09,69.66 64.09,65.91 64.84,65.16 66.79,65.16 67.29,64.66 67.29,62.91 L3.2
  Bottom 0.3: v71.69,69.92 71.32,69.92 69.73,71.51 65.94,71.51 v64.39,69.96
N$27  (via drill 0.5 pad 0.25)
  Top 0.3: IC1.22 67.06,25.28 v67.48,24.91 | v65.48,6.21 61.66,6.21 R3.2
  Bottom 0.3: v67.48,24.91 67.48,18.75 66.39,17.86 66.39,7.1 v65.48,6.21
N$28  (via drill 0.5 pad 0.25)
  Top 0.3: IC1.23 63.21,25.93 v63.09,25.8 | v57.14,6.9 57.14,6.6 57.54,6.21 59.11,6.21 R4.2
  Bottom 0.3: v63.09,25.8 63.09,13.96 60.34,11.21 60.34,10.11 v57.14,6.9
N$29
  Top 0.3: U$3.2 L4.1
N$30  (via drill 0.5 pad 0.25)
  Top 0.3: JP2.1 20.7,4.47 20.79,4.55 20.79,1.75 21.18,1.35 37.84,1.35 40.84,4.35 40.84,10.48 v40.78,10.53 | v47.58,27.89 58.29,27.89 IC1.3
  Bottom 0.3: v40.78,10.53 40.78,21.09 v47.58,27.89
N$31  (via drill 0.5 pad 0.25)
  Top 0.3: JP2.2 23.16,6.73 v23.84,7.4 | v35.43,22.66 58.29,22.66 IC1.11
  Bottom 0.3: v23.84,7.4 23.84,11.07 v35.43,22.66
N$32
  Top 0.3: JP3.1 36.59,19.26 38.7,21.38 IC1.13
N$33  (via drill 0.5)
  Top 0.3: v36.59,44.05 35.69,43.1 U4.3
  Bottom 0.3: JP5.1 42.12,48.7 37.48,44.05 v36.59,44.05
N$34  (via drill 0.5 pad 0.25)
  Top 0.3: v54.73,19.5 55.89,20.66 58.23,20.66 IC1.14
  Bottom 0.3: JP3.2 34.05,5.71 37.59,9.25 40.84,9.25 42.28,10.71 44.39,10.71 47.48,13.8 49.04,13.8 v54.73,19.5
N$35
  Top 0.3: JP3.3 31.5,7.07 35.39,10.96 35.39,19.61 37.84,22.05 58.28,22.05 IC1.12
N$36
  Top 0.3: R5.1 LED3.C
N$37
  Top 1.27: B1.~1 54.81,17.31 L5.2
N$38  (via drill 0.5)
  Top 0.3: U4.2 31.91,44.01 v34.44,44.01
  Bottom 0.3: JP5.4 44.5,77.33 43.34,76.16 43.34,48.85 37.73,43.16 35.19,43.16 v34.44,44.01
N$39
  Top 0.3: U4.56 39.84,48.76 45.79,54.7 45.79,61.85 57.69,73.76 57.69,74.85 JP4.5
N$40  (via drill 0.5 pad 0.25)
  Top 0.3: C19.+ 72.49,25.56 73.18,26.25 L4.2 69.45,28.89 62.44,35.91 62.44,40.7 v64.69,42.95 | IC1.20 C19.+ | C19.+ 72.86,24.36 72.91,24.3 v75.54,24.3 | v59.59,45.41 C4.1 | R1.2 61.23,48.63 C5.1 v59.59,48.62 v59.59,48.6
  Bottom 0.3: JP1.1 73.68,4.54 79.98,10.86 79.98,21.8 77.54,24.25 75.59,24.25 v75.54,24.3 | v64.69,42.95 64.69,43.26 62.54,45.41 v59.59,45.41 v59.59,48.6
N$41  (via drill 0.5, 0.5 pad 0.25)
  Top 0.3: v69.89,67.21 74.1,67.21 U5.12 | v35.28,36.05 35.28,36.01 35.19,35.91 U4.12 24.59,35.91 v24.43,36.05 | v10.69,60.35 19.79,51.26 19.79,36.8 v20.24,36.35 | U1.12 10.76,76.83 v10.66,76.93 | U$1.15 19.45,13.42 v20.74,14.71
  Bottom 0.3: v69.89,67.21 63.94,67.21 35.28,38.66 v35.28,36.05 | v10.66,76.93 10.66,60.38 v10.69,60.35 | v20.74,14.71 20.74,21.05 23.93,24.25 23.93,35.55 v24.43,36.05 24.14,36.35 v20.24,36.35
N$44  (via drill 0.5 pad 0.25)
  Top 0.3: JP4.9 v62.79,73.41 | v58.89,73.41 58.89,66.03 41.46,48.6 41.46,46.34 U4.54
  Bottom 0.3: v62.79,73.41 v58.89,73.41
N$51  (via drill 0.5, 0.5 pad 0.25)
  Top 0.3: v31.79,30.05 29.18,32.66 29.18,35.1 | U$1.5 9.69,9.61 v9.74,9.65 | 31.74,30 v31.79,30.05 | v30.68,27.55 30.68,28.95 v31.79,30.05 | U1.3 10.76,69.03 10.81,69.03 v11.54,68.31 | v15.68,35.1 v18.89,35.1 | 29.18,35.1 U4.13 | 29.18,35.1 v22.54,35.1 | U5.3 79.23,67.31 v79.84,66.71
  Bottom 0.3: v31.79,30.05 37.26,35.03 68.47,35.03 78.48,45.05 78.48,61.01 79.98,62.7 79.98,66.51 79.84,66.66 v79.84,66.71 | v9.74,9.65 17.54,9.65 22.18,14.3 22.18,19 29.54,26.36 | 29.54,26.36 29.59,26.41 | 29.54,26.36 v30.68,27.55 | v15.68,35.1 11.74,39.01 11.59,39.16 11.59,60.26 11.84,60.51 11.84,68.01 v11.54,68.31 | v18.89,35.1 v22.54,35.1
RESET  (via drill 0.5 pad 0.25)
  Top 0.3: S1.3 21.22,31.79 23.68,34.26 26.14,34.26 29.34,31.05 29.34,27.3 30.59,26.05 33.23,26.05 35.84,28.66 U4.20 35.84,34.26 36.59,35.01 v36.59,38.51 | 21.11,31.82 S1.3 | R6.1 21.06,25.22 S1.4 S1.3 | JP5.5 47.2,65.94 v47.23,65.91 | v48.09,53.85 v49.98,51.95
  Bottom 0.3: JP5.5 49.22,74.79 50.59,76.16 56.45,76.16 JP4.6 | v47.23,65.91 47.23,54.7 v48.09,53.85 | v49.98,51.95 49.98,51.91 v36.59,38.51
SCK  (via drill 0.5, 0.5 pad 0.25)
  Top 0.3: v12.54,59.76 14.59,57.7 14.59,57.66 20.59,51.66 20.59,48.41 v25.24,43.76 27.39,41.6 | v12.49,69.96 12.34,70.11 12.34,71.94 U1.5 | JP5.3 44.67,63.09 v39.69,58.1 | U$1.16 16.7,30.92 27.39,41.6 | U5.5 79.04,68.91 v79.48,69.36 | 27.39,41.6 28.93,40.05 28.93,38.2 30.43,36.7 U4.11
  Bottom 0.3: v12.54,59.76 12.54,69.91 v12.49,69.96 | v39.69,58.1 39.73,58.3 27.99,46.51 v25.24,43.76 | v79.48,69.36 79.48,71.61 78.94,72.21 47,72.21 JP5.3
VCC  (via drill 0.5 pad 0.25)
  Top 0.3: 59.05,38.74 U$4.3 | C12.2 C2.1 27.39,12.46 26.89,12.96 24.99,12.96 23.99,13.96 23.99,15.8 25.14,16.95 26.54,16.95 27.4,17.82 C26.1 | 27.39,18.13 C26.1 | U5.14 74.09,64.79 C6.+ 63.73,60.16 63.34,60.55 63.34,62.73 L3.1 C18.1 61.23,71.62 60.25,72.61 JP4.7 58.96,76.16 56.44,76.16 55.18,77.41 JP4.4 | 59.39,27.2 58.33,27.2 IC1.4 58.3,27.2 59.94,27.2 | U$4.3 58.73,39.05 52.04,39.05 50.04,41.05 50.04,47.01 48.69,48.35 44.03,48.35 43.06,47.38 43.06,46.34 U4.52 43.03,45.51 42.44,44.91 41.44,44.91 | v52.23,1.75 v52.24,1.76 52.28,1.76 52.48,1.55 59.11,1.55 LED2.A 59.17,1.56 61.64,1.56 LED1.A | v59.98,23.45 59.94,23.45 59.94,27.2 | 59.94,27.2 59.94,30.41 58.94,31.41 58.94,33.91 | 58.94,33.91 58.94,38.58 U$4.3 | LED3.A 58.78,33.75 58.94,33.91 | U$1.6 6,8.34 v5.64,8.71 | v5.69,17.3 5.69,19.94 L1.1 11.61,20.33 v14.93,17 | v19.29,16.36 22.54,16.36 22.84,16.66 22.84,18.04 R6.2 24.06,18.12 v24.09,18.16 | v28.89,18.16 C26.1 | 2.44,64.21 4.34,62.3 5.41,62.3 | 5.41,62.3 L2.1 | 37.03,62.6 37.03,62.26 | 37.03,62.26 37.03,60.85 36.98,60.8 36.98,61.3 L6.2 | 5.41,62.3 6.79,62.3 v12.89,56.2 | v22.29,66.61 22.29,65.16 C10.1 36.41,65.14 37.03,64.51 37.03,62.6 | 41.44,44.91 33.28,44.91 31.74,46.45 v31.74,47.26 30.68,46.2 C28.2 | v39.89,53.3 38.98,52.41 37.98,52.41 36.89,51.3 v35.84,51.3 | v40.44,62.55 37.34,62.55 37.03,62.26 | 37.03,62.6 37.09,62.55 | 37.09,62.55 37.14,62.51 37.14,62.6 37.09,62.55 | 37.09,62.55 v40.44,62.55 | v40.44,62.55 40.48,62.51 40.48,75.69 JP5.2 | 41.44,44.91 41.39,44.85 41.39,38.66 36.64,33.91 U4.21 36.64,26.36 31.41,21.12 C25.1 27.4,21.11 C26.1
  Top 0.406: 2.44,64.21 2.44,71.01 5.84,74.41 8.04,74.41 8.09,74.46 8.09,74.79 U1.14
  Bottom 0.3: JP4.4 55.13,77.41 53.89,78.66 43.45,78.66 JP5.2 | v52.23,1.75 52.14,1.85 52.14,15.61 v59.98,23.45 | v5.64,8.71 5.64,17.25 v5.69,17.3 | v14.93,17 18.64,17 v19.29,16.36 | v24.09,18.16 v28.89,18.16 | v12.89,56.2 15.93,56.2 22.29,62.55 v22.29,66.61 | v39.89,53.3 40.53,53.95 40.53,62.45 v40.44,62.55 | v31.74,47.26 31.79,47.26 v35.84,51.3

### Text on the board
tNames: Vcc | RXD0 | GND | GND | VTref | RESET | GND | TXD0 | SCK | RESET | TCK | TDO | TMS | Vcc | TDI | RESET | CTS | GND | CBUS3 | CBUS2 | PWR | USB | RTS | GND | CBUS4 | GND